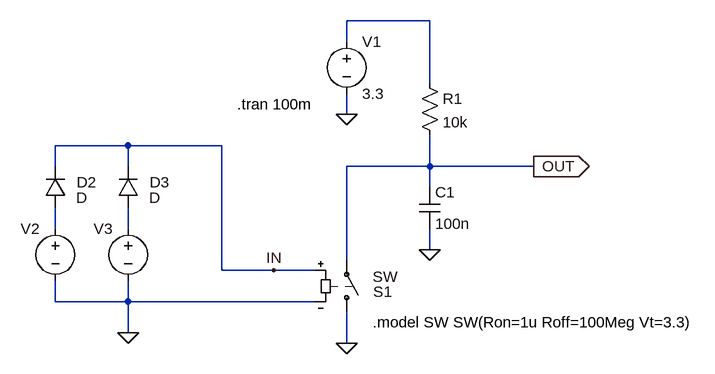
[diagram p0: schematic v1.0.asc]
v1.0.asc, the LTspice schematic file:
Version 4.1
SHEET 1 956 680
WIRE 432 -128 304 -128
WIRE 304 -96 304 -128
WIRE 432 -32 432 -128
WIRE 304 16 304 -16
WIRE -32 64 -144 64
WIRE 112 64 -32 64
WIRE -144 96 -144 64
WIRE -32 96 -32 64
WIRE 432 96 432 48
WIRE 432 96 304 96
WIRE 592 96 432 96
WIRE 432 128 432 96
WIRE -144 192 -144 160
WIRE -32 192 -32 160
WIRE 432 224 432 192
WIRE 304 240 304 96
WIRE 112 256 112 64
WIRE 192 256 112 256
WIRE 256 256 192 256
WIRE -144 304 -144 272
WIRE -32 304 -32 272
WIRE -32 304 -144 304
WIRE 256 304 -32 304
WIRE -32 352 -32 304
WIRE 304 368 304 320
FLAG 304 16 0
FLAG 592 96 OUT
IOPIN 592 96 Out
FLAG 192 256 IN
FLAG 304 368 0
FLAG 432 224 0
FLAG -32 352 0
SYMBOL sw 304 336 M180
WINDOW 0 41 47 Left 2
WINDOW 3 40 70 Left 2
SYMATTR InstName S1
SYMBOL res 416 -48 R0
SYMATTR InstName R1
SYMATTR Value 10k
SYMBOL voltage 304 -112 R0
WINDOW 123 0 0 Left 0
WINDOW 39 0 0 Left 0
SYMATTR InstName V1
SYMATTR Value 3.3
SYMBOL voltage -32 176 M0
WINDOW 3 41 64 Invisible 2
WINDOW 123 0 0 Left 0
WINDOW 39 0 0 Left 0
SYMATTR Value PULSE(0 5 15m 1n 1n 250u 500u 10)
SYMATTR InstName V3
SYMBOL voltage -144 176 M0
WINDOW 3 41 64 Invisible 2
WINDOW 123 0 0 Left 0
WINDOW 39 39 69 Left 2
SYMATTR Value PULSE(0 5 20m 1n 1n 30m 80m 1)
SYMATTR InstName V2
SYMBOL cap 416 128 R0
SYMATTR InstName C1
SYMATTR Value 100n
SYMATTR SpiceLine Rser=0.05
SYMBOL diode -160 160 M180
WINDOW 0 49 40 Left 2
WINDOW 3 48 16 Left 2
SYMATTR InstName D2
SYMBOL diode -48 160 M180
WINDOW 0 49 40 Left 2
WINDOW 3 48 16 Left 2
SYMATTR InstName D3
TEXT 136 0 Left 2 !.tran 100m
TEXT 344 336 Left 2 !.model SW SW(Ron=1u Roff=100Meg Vt=3.3)

The netlist it stands for:
* v1.0.asc
S1 0 OUT IN 0 SW
R1 N001 OUT 10k
V1 N001 0 3.3
V3 N003 0 PULSE(0 5 15m 1n 1n 250u 500u 10)
V2 N002 0 PULSE(0 5 20m 1n 1n 30m 80m 1)
C1 OUT 0 100n Rser=0.05
D2 N002 IN D
D3 N003 IN D
.model D D
.lib standard.dio
.tran 100m
.model SW SW(Ron=1u Roff=100Meg Vt=3.3)
.backanno
.end